# EAGLE design controller (EAGLE 8.3.1)
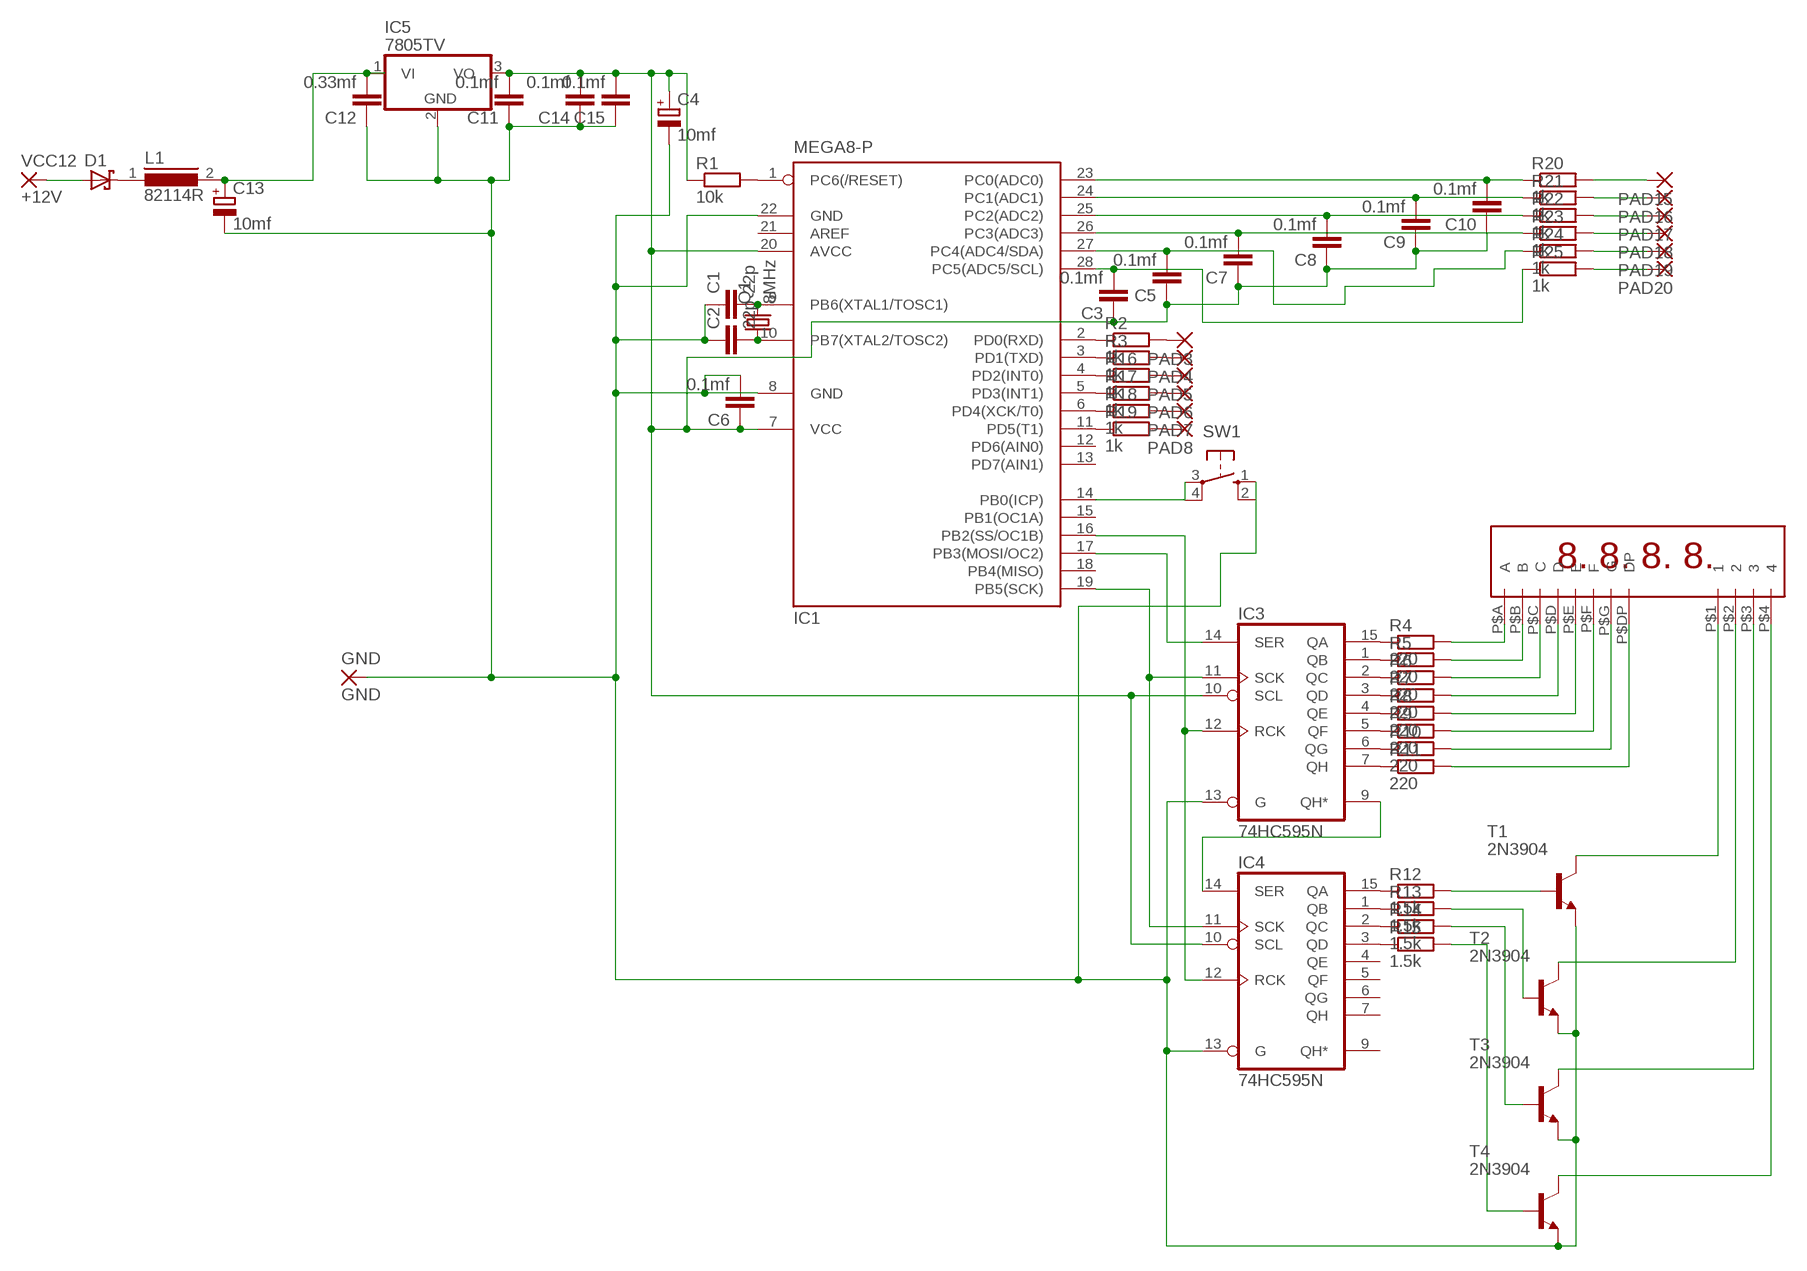
[diagram p0: schematic, sheet 1]

## Parts
C1  22p  C-EU050-024X044  [C050-024X044]
C2  22p  C-EU050-024X044  [C050-024X044]
C3  0.1mf  C-EU050-024X044  [C050-024X044]
C4  10mf  CPOL-EUE1.8-4  [E1,8-4]
C5  0.1mf  C-EU050-024X044  [C050-024X044]
C6  0.1mf  C-EU050-024X044  [C050-024X044]
C7  0.1mf  C-EU050-024X044  [C050-024X044]
C8  0.1mf  C-EU050-024X044  [C050-024X044]
C9  0.1mf  C-EU050-024X044  [C050-024X044]
C10  0.1mf  C-EU050-024X044  [C050-024X044]
C11  0.1mf  C-EU050-024X044  [C050-024X044]
C12  0.33mf  C-EU050-024X044  [C050-024X044]
C13  10mf  CPOL-EUE1.8-4  [E1,8-4]
C14  0.1mf  C-EU050-024X044  [C050-024X044]
C15  0.1mf  C-EU050-024X044  [C050-024X044]
D1  SCHOTTKY-DIODEDO35-7  [DO35-7]
GND  GND  2,54/1,1  [2,54/1,1]
IC1  MEGA8-P  [DIL28-3]
IC3  74HC595N  [DIL16]
IC4  74HC595N  [DIL16]
IC5  7805TV  [TO220V]
L1  82114R  [82114R]
PAD3  1,6/0,8  [1,6/0,8]
PAD4  1,6/0,8  [1,6/0,8]
PAD5  1,6/0,8  [1,6/0,8]
PAD6  1,6/0,8  [1,6/0,8]
PAD7  1,6/0,8  [1,6/0,8]
PAD8  1,6/0,8  [1,6/0,8]
PAD15  1,6/0,8  [1,6/0,8]
PAD16  1,6/0,8  [1,6/0,8]
PAD17  1,6/0,8  [1,6/0,8]
PAD18  1,6/0,8  [1,6/0,8]
PAD19  1,6/0,8  [1,6/0,8]
PAD20  1,6/0,8  [1,6/0,8]
Q1  8MHz  CRYSTALHC49S  [HC49/S]
R1  10k  R-EU_0204/7  [0204/7]
R2  1k  R-EU_0204/7  [0204/7]
R3  1k  R-EU_0204/7  [0204/7]
R4  220  R-EU_0204/7  [0204/7]
R5  220  R-EU_0204/7  [0204/7]
R6  220  R-EU_0204/7  [0204/7]
R7  220  R-EU_0204/7  [0204/7]
R8  220  R-EU_0204/7  [0204/7]
R9  220  R-EU_0204/7  [0204/7]
R10  220  R-EU_0204/7  [0204/7]
R11  220  R-EU_0204/7  [0204/7]
R12  1.5k  R-EU_0204/7  [0204/7]
R13  1.5k  R-EU_0204/7  [0204/7]
R14  1.5k  R-EU_0204/7  [0204/7]
R15  1.5k  R-EU_0204/7  [0204/7]
R16  1k  R-EU_0204/7  [0204/7]
R17  1k  R-EU_0204/7  [0204/7]
R18  1k  R-EU_0204/7  [0204/7]
R19  1k  R-EU_0204/7  [0204/7]
R20  1k  R-EU_0204/7  [0204/7]
R21  1k  R-EU_0204/7  [0204/7]
R22  1k  R-EU_0204/7  [0204/7]
R23  1k  R-EU_0204/7  [0204/7]
R24  1k  R-EU_0204/7  [0204/7]
R25  1k  R-EU_0204/7  [0204/7]
SW1  10-XX  [B3F-10XX]
T1  2N3904  [TO92]
T2  2N3904  [TO92]
T3  2N3904  [TO92]
T4  2N3904  [TO92]
U$1  KL-5641-ASR  [KL-5641-ASR]
VCC12  +12V  2,54/1,1  [2,54/1,1]

## Nets
GND: C1.1 C2.1 C4.- C6.2 C11.1 C12.1 C13.- C14.1 C15.1 GND.1(P) IC1.8(GND) IC1.22(GND) IC3.13(G) IC4.13(G) IC5.2(GND) SW1.1(S) SW1.2(S1) T1.3(E) T2.3(E) T3.3(E) T4.3(E)
N$1: IC1.1(PC6(/RESET)) R1.2
N$2: D1.C L1.1
N$3: IC1.2(PD0(RXD)) R2.1
N$4: R4.2 U$1.P$A(A)
N$5: R5.2 U$1.P$B(B)
N$6: IC1.3(PD1(TXD)) R3.1
N$7: C1.2 IC1.9(PB6(XTAL1/TOSC1)) Q1.2
N$8: C2.2 IC1.10(PB7(XTAL2/TOSC2)) Q1.1
N$9: R6.2 U$1.P$C(C)
N$10: R7.2 U$1.P$D(D)
N$11: R8.2 U$1.P$E(E)
N$12: R9.2 U$1.P$F(F)
N$13: IC1.16(PB2(SS/OC1B)) IC3.12(RCK) IC4.12(RCK)
N$14: IC1.17(PB3(MOSI/OC2)) IC3.14(SER)
N$15: IC1.19(PB5(SCK)) IC3.11(SCK) IC4.11(SCK)
N$16: C12.2 C13.+ IC5.1(VI) L1.2
N$17: R10.2 U$1.P$G(G)
N$18: R11.2 U$1.P$DP(DP)
N$19: IC3.15(QA) R4.1
N$20: IC3.1(QB) R5.1
N$21: IC3.2(QC) R6.1
N$22: IC3.3(QD) R7.1
N$23: IC3.4(QE) R8.1
N$24: IC3.5(QF) R9.1
N$25: IC3.6(QG) R10.1
N$26: IC3.7(QH) R11.1
N$27: IC4.15(QA) R12.1
N$28: IC4.1(QB) R13.1
N$29: IC4.2(QC) R14.1
N$30: IC4.3(QD) R15.1
N$31: R12.2 T1.2(B)
N$32: R13.2 T2.2(B)
N$33: R14.2 T3.2(B)
N$34: R15.2 T4.2(B)
N$35: D1.A VCC12.1(P)
N$36: T1.1(C) U$1.P$1
N$37: T2.1(C) U$1.P$2
N$38: T3.1(C) U$1.P$3
N$39: T4.1(C) U$1.P$4
N$40: C10.2 IC1.23(PC0(ADC0)) R20.1
N$41: C9.2 IC1.24(PC1(ADC1)) R21.1
N$42: C8.2 IC1.25(PC2(ADC2)) R22.1
N$43: C7.2 IC1.26(PC3(ADC3)) R23.1
N$44: C5.2 IC1.27(PC4(ADC4/SDA)) R24.1
N$45: PAD16.1(P) R21.2
N$46: IC1.4(PD2(INT0)) R16.1
N$47: IC1.5(PD3(INT1)) R17.1
N$48: IC1.6(PD4(XCK/T0)) R18.1
N$49: IC1.11(PD5(T1)) R19.1
N$50: PAD3.1(P) R2.2
N$51: PAD4.1(P) R3.2
N$52: PAD5.1(P) R16.2
N$53: PAD6.1(P) R17.2
N$54: PAD7.1(P) R18.2
N$55: PAD8.1(P) R19.2
N$56: IC1.14(PB0(ICP)) SW1.3(P) SW1.4(P1)
N$58: PAD15.1(P) R20.2
N$59: PAD17.1(P) R22.2
N$60: PAD18.1(P) R23.2
N$61: PAD19.1(P) R24.2
N$62: PAD20.1(P) R25.2
N$63: C3.2 IC1.28(PC5(ADC5/SCL)) R25.1
N$64: IC3.9(QH*) IC4.14(SER)
VCC: C3.1 C4.+ C5.1 C6.1 C7.1 C8.1 C9.1 C10.1 C11.2 C14.2 C15.2 IC1.7(VCC) IC1.20(AVCC) IC3.10(SCL) IC4.10(SCL) IC5.3(VO) R1.1
Unconnected: IC1.12(PD6(AIN0)) IC1.13(PD7(AIN1)) IC1.15(PB1(OC1A)) IC1.18(PB4(MISO)) IC1.21(AREF) IC4.4(QE) IC4.5(QF) IC4.6(QG) IC4.7(QH) IC4.9(QH*)

## Power pins joined to a net without a drawn wire
GND: IC3.8(GND) IC4.8(GND)
VCC: IC3.16(VCC) IC4.16(VCC)

## Library data of the parts
C1-C3 C5-C12 C14 C15 = resistor:C-EU: CAPACITOR, European symbol
C4 C13 = resistor:CPOL-EU: POLARIZED CAPACITOR, European symbol
D1 = adafruit:SCHOTTKY-DIODE: Schottky Diode
GND VCC12 = wirepad:2,54/1,1: THROUGH-HOLE PAD
IC1 = atmel:MEGA8-P: MICROCONTROLLER 8 Kbytes FLASH, 1 kbytes SRAM, 512 bytes EEPROM, USART, 4-channel 10 bit ADC, 2-channel 8 bit ADC Pin compatible with Atmega48, ATMega88, ATMega168 Source: avr.lbr; OC_FARNELL: unknown; OC_NEWARK: unknown
IC3 IC4 = 74xx-eu:74*595: 8-bit SHIFT REGISTER, output latch
IC5 = linear:78*: Positive VOLTAGE REGULATOR Source: http://cache.national.com/ds/LM/LM78L05.pdf http://www.fairchildsemi.com/ds/LM/LM7805.pdf
L1 = inductors:82114R: INDUCTOR
PAD3-PAD8 PAD15-PAD20 = wirepad:1,6/0,8: THROUGH-HOLE PAD
Q1 = adafruit:CRYSTAL: CRYSTAL; OC_FARNELL: 1667008; OC_NEWARK: unknown
R1-R25 = resistor:R-EU_: RESISTOR, European symbol
SW1 = buttons:10-XX: OMRON SWITCH
T1-T4 = transistor:2N3904: NPN TRANSISTOR
U$1 = mgvc:KL-5641-ASR: Индикатор 4 разряда 0.56" Красный, катод, черный фон KL-5641-ASR

## Board
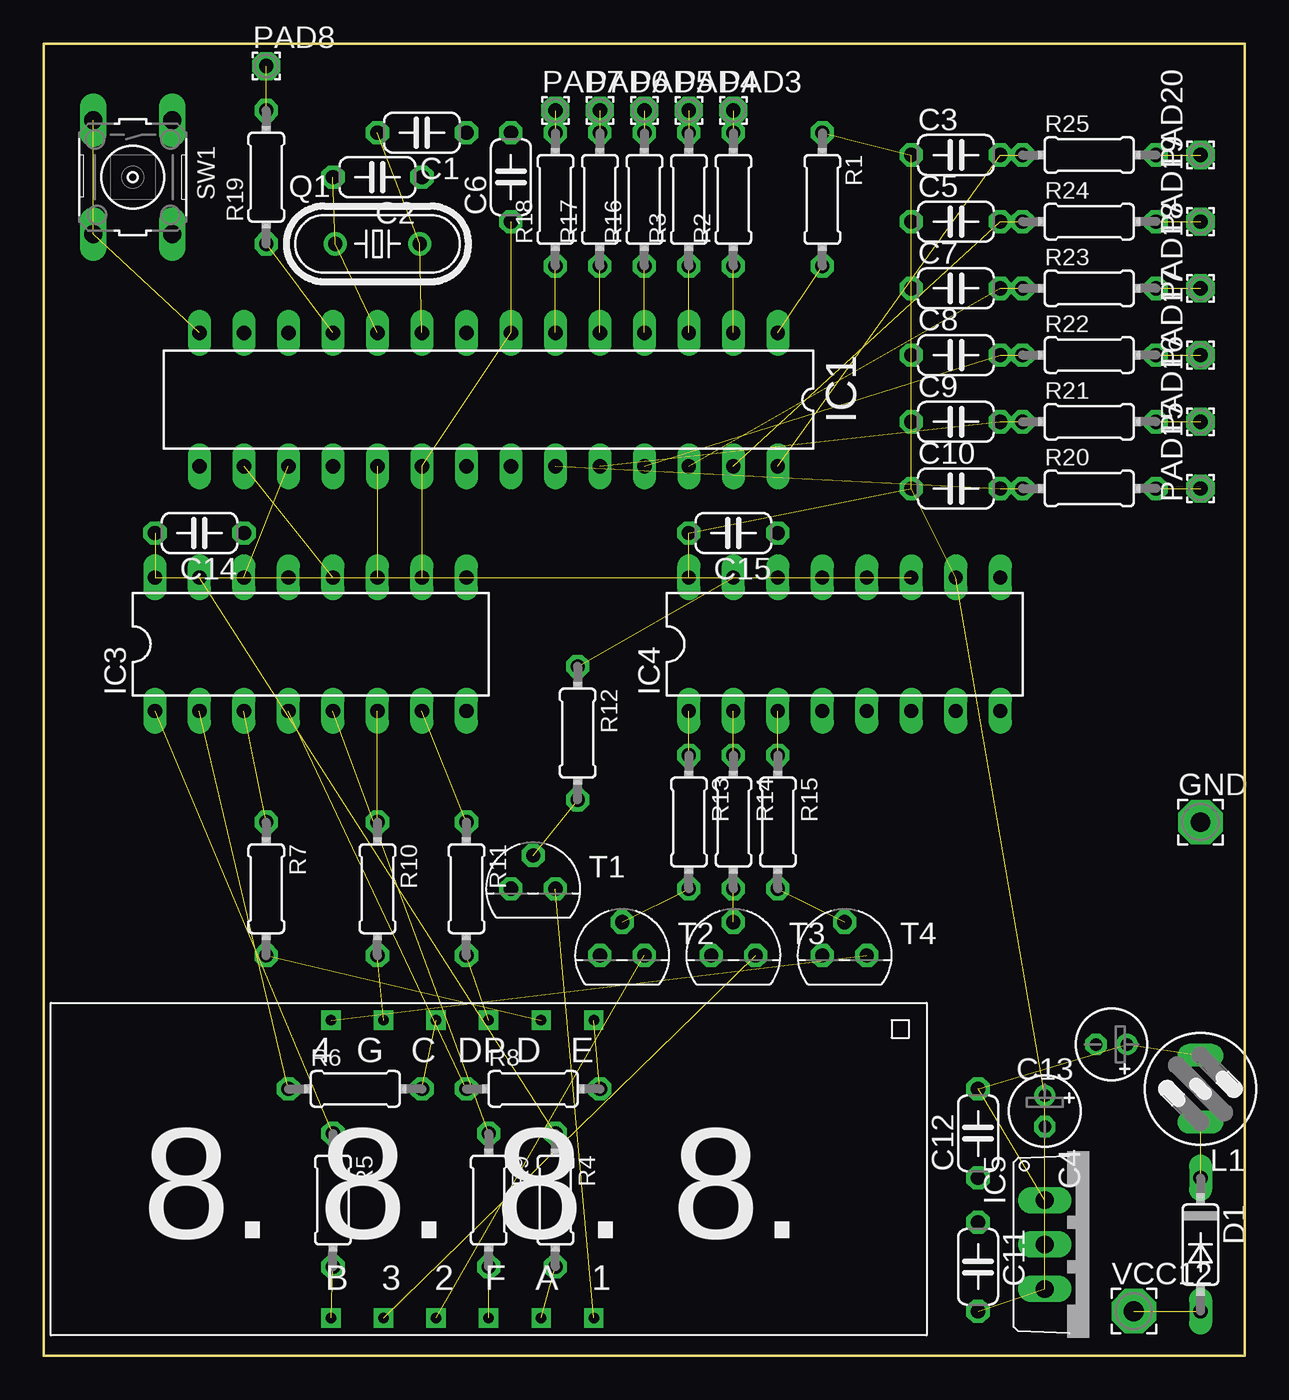
[diagram p1: board, top side]
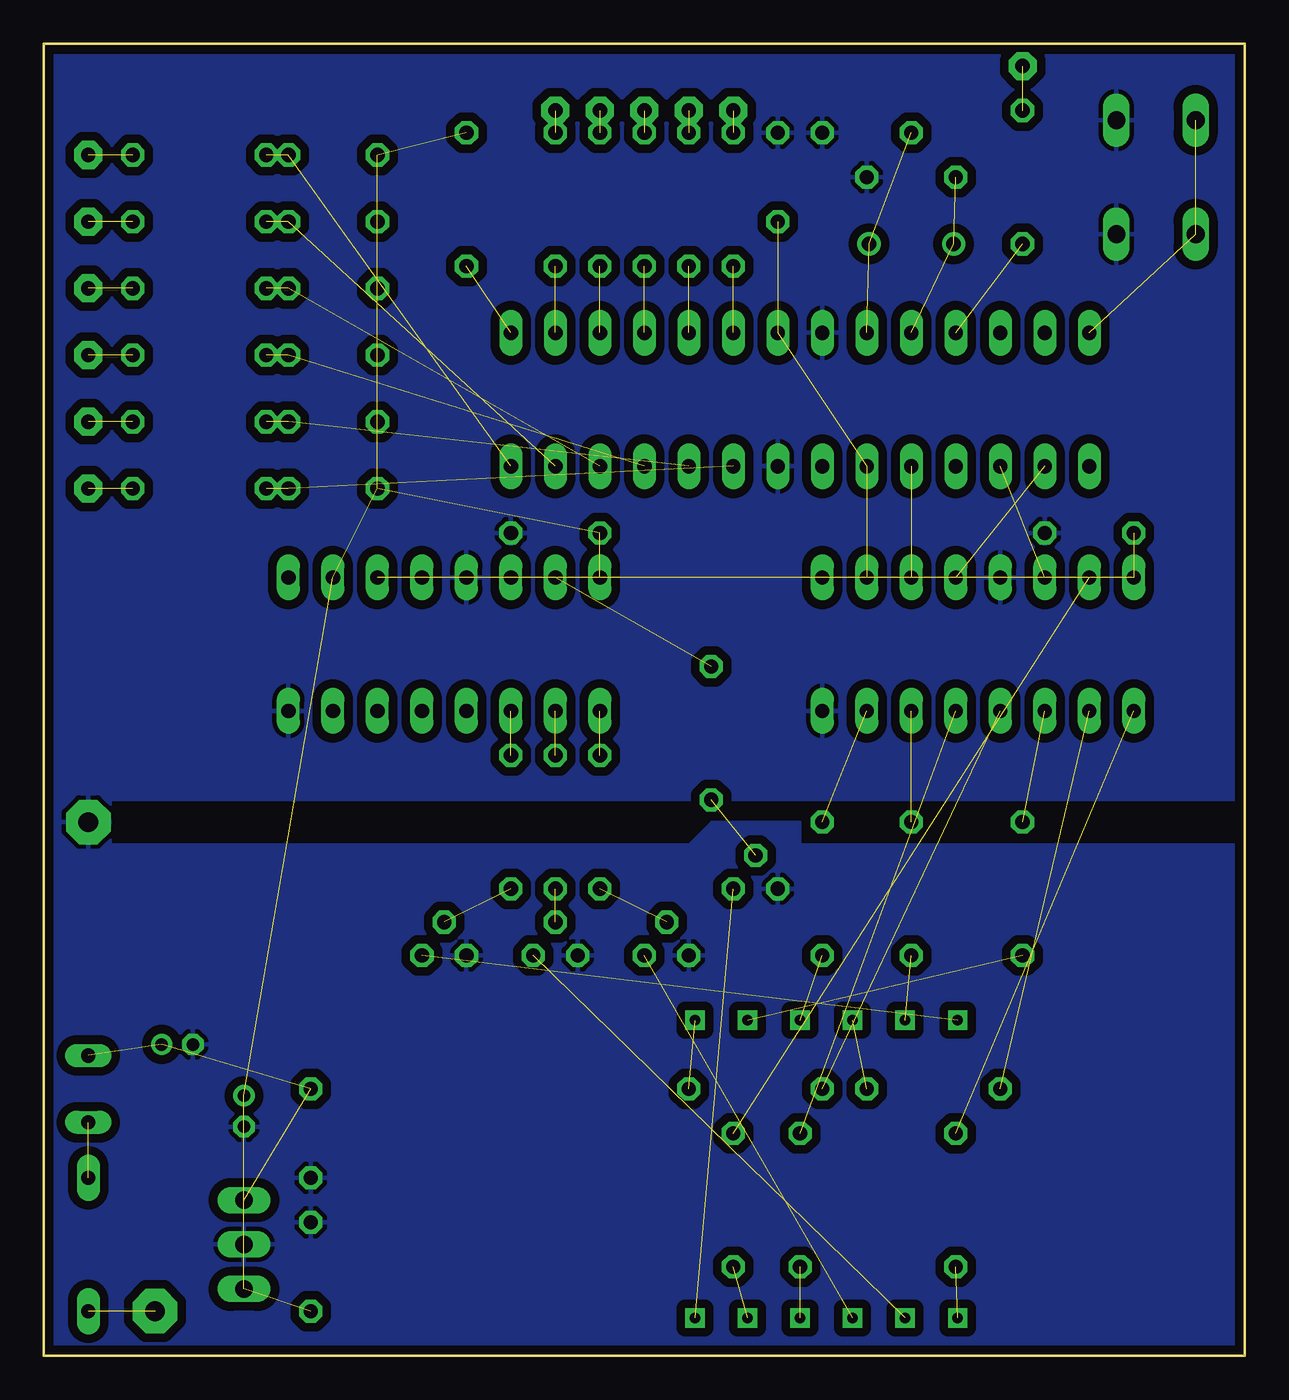
[diagram p2: board, bottom side, seen from below]

Size 68.58 x 74.93 mm. Coordinates in mm from the lower left corner, seen from the top.
Outline: 0,74.93 0,0 68.58,0 68.58,74.93 0,74.93
Copper layers (1*16): Top 0.035mm / dielectric 1.5mm / Bottom 0.035mm
Design rules "default *": minimum track width 0.7mm, minimum drill 0.35mm, track to track 0.5mm, track to pad 0.5mm, pad to pad 6mil, via to via 6mil, smd to smd 6mil, copper to edge 0.5mm, drill to drill 6mil, minimum pad ring 10mil, minimum via ring 8mil, stop-mask expansion 4mil, vias tented up to drill 0mil, thermal gap 10mil

### Footprints (pad centres in the part's own frame; a part is rotated, then mirrored left to right if it is on the bottom)
C050-024X044 = drill 0.813 octagon: 1 -2.54,0; 2 2.54,0
E1,8-4 = drill 0.711 pad 1.168: + -0.889,0 | drill 0.711 pad 1.168 octagon: - 0.889,0
DO35-7 = drill 0.813 long: A 3.81,0; C -3.81,0
2,54/1,1 = drill 1.118 pad 2.54 octagon: 1 0,0
DIL28-3 = drill 0.813 long: 1 -16.51,-3.81; 2 -13.97,-3.81; 3 -11.43,-3.81; 4 -8.89,-3.81; 5 -6.35,-3.81; 6 -3.81,-3.81; 7 -1.27,-3.81; 8 1.27,-3.81; 9 3.81,-3.81; 10 6.35,-3.81; 11 8.89,-3.81; 12 11.43,-3.81; 13 13.97,-3.81; 14 16.51,-3.81; 15 16.51,3.81; 16 13.97,3.81; 17 11.43,3.81; 18 8.89,3.81; 19 6.35,3.81; 20 3.81,3.81; 21 1.27,3.81; 22 -1.27,3.81; 23 -3.81,3.81; 24 -6.35,3.81; 25 -8.89,3.81; 26 -11.43,3.81; 27 -13.97,3.81; 28 -16.51,3.81
DIL16 = drill 0.813 long: 1 -8.89,-3.81; 2 -6.35,-3.81; 3 -3.81,-3.81; 4 -1.27,-3.81; 5 1.27,-3.81; 6 3.81,-3.81; 7 6.35,-3.81; 8 8.89,-3.81; 9 8.89,3.81; 10 6.35,3.81; 11 3.81,3.81; 12 1.27,3.81; 13 -1.27,3.81; 14 -3.81,3.81; 15 -6.35,3.81; 16 -8.89,3.81
TO220V = drill 1.016 long: 1 -2.54,-2.54; 2 0,-2.54; 3 2.54,-2.54
82114R = drill 0.813 long: 1 0,1.905; 2 0,-1.905
1,6/0,8 = drill 0.813 pad 1.6 octagon: 1 0,0
HC49/S = drill 0.813: 1 -2.413,0; 2 2.413,0
0204/7 = drill 0.813 octagon: 1 -3.81,0; 2 3.81,0
B3F-10XX = drill 1.016 long: 1 -3.251,2.261; 2 3.251,2.261; 3 -3.251,-2.261; 4 3.251,-2.261
TO92 = drill 0.813 octagon: 1 1.27,0; 2 0,1.905; 3 -1.27,0
KL-5641-ASR = drill 0.6 square: P$1 -6,8; P$2 3,8; P$3 6,8; P$4 9,-9; P$A -3,8; P$B 9,8; P$C 3,-9; P$D -3,-9; P$DP 0,-9; P$E -6,-9; P$F 0,8; P$G 6,-9

### Placement (x,y rotation side)
C1  21.59,69.85 180 top
C2  19.05,67.31 180 top
C3  52.07,68.58 0 top
C4  57.15,13.97 270 top
C5  52.07,64.77 0 top
C6  26.67,67.31 90 top
C7  52.07,60.96 0 top
C8  52.07,57.15 0 top
C9  52.07,53.34 0 top
C10  52.07,49.53 0 top
C11  53.34,5.08 270 top
C12  53.34,12.7 90 top
C13  60.96,17.78 180 top
C14  8.89,46.99 180 top
C15  39.37,46.99 180 top
D1  66.04,6.35 270 top
GND  66.04,30.48 0 top
IC1  25.4,54.61 180 top
IC3  15.24,40.64 0 top
IC4  45.72,40.64 0 top
IC5  59.69,6.35 270 top
L1  66.04,15.24 180 top
PAD3  39.37,71.12 0 top
PAD4  36.83,71.12 0 top
PAD5  34.29,71.12 0 top
PAD6  31.75,71.12 0 top
PAD7  29.21,71.12 0 top
PAD8  12.7,73.66 0 top
PAD15  66.04,49.53 90 top
PAD16  66.04,53.34 90 top
PAD17  66.04,57.15 90 top
PAD18  66.04,60.96 90 top
PAD19  66.04,64.77 90 top
PAD20  66.04,68.58 90 top
Q1  19.05,63.5 0 top
R1  44.45,66.04 270 top
R2  39.37,66.04 90 top
R3  36.83,66.04 90 top
R4  29.21,8.89 270 top
R5  16.51,8.89 270 top
R6  17.78,15.24 0 top
R7  12.7,26.67 270 top
R8  27.94,15.24 0 top
R9  25.4,8.89 270 top
R10  19.05,26.67 270 top
R11  24.13,26.67 270 top
R12  30.48,35.56 270 top
R13  36.83,30.48 270 top
R14  39.37,30.48 270 top
R15  41.91,30.48 270 top
R16  34.29,66.04 90 top
R17  31.75,66.04 90 top
R18  29.21,66.04 90 top
R19  12.7,67.31 90 top
R20  59.69,49.53 0 top
R21  59.69,53.34 0 top
R22  59.69,57.15 0 top
R23  59.69,60.96 0 top
R24  59.69,64.77 0 top
R25  59.69,68.58 0 top
SW1  5.08,67.31 270 top
T1  27.94,26.67 0 top
T2  33.02,22.86 0 top
T3  39.37,22.86 0 top
T4  45.72,22.86 0 top
U$1  25.4,10.16 180 top
VCC12  62.23,2.54 0 top

### Tracks (layer width: path | path; a pad name or v marks a point on that pad's centre or on a via)
GND
  pour Bottom: 68.58,33.02 68.58,73.66 68.58,74.93 0,74.93 0,31.75 63.5,31.75 64.77,31.75 64.77,29.21 0,29.21 0,0 68.58,0
N$1  (1 unrouted)
N$2  (1 unrouted)
N$3  (1 unrouted)
N$4  (1 unrouted)
N$5  (1 unrouted)
N$6  (1 unrouted)
N$7  (2 unrouted)
N$8  (2 unrouted)
N$9  (1 unrouted)
N$10  (1 unrouted)
N$11  (1 unrouted)
N$12  (1 unrouted)
N$13  (2 unrouted)
N$14  (1 unrouted)
N$15  (2 unrouted)
N$16  (3 unrouted)
N$17  (1 unrouted)
N$18  (1 unrouted)
N$19  (1 unrouted)
N$20  (1 unrouted)
N$21  (1 unrouted)
N$22  (1 unrouted)
N$23  (1 unrouted)
N$24  (1 unrouted)
N$25  (1 unrouted)
N$26  (1 unrouted)
N$27  (1 unrouted)
N$28  (1 unrouted)
N$29  (1 unrouted)
N$30  (1 unrouted)
N$31  (1 unrouted)
N$32  (1 unrouted)
N$33  (1 unrouted)
N$34  (1 unrouted)
N$35  (1 unrouted)
N$36  (1 unrouted)
N$37  (1 unrouted)
N$38  (1 unrouted)
N$39  (1 unrouted)
N$40  (2 unrouted)
N$41  (2 unrouted)
N$42  (2 unrouted)
N$43  (2 unrouted)
N$44  (2 unrouted)
N$45  (1 unrouted)
N$46  (1 unrouted)
N$47  (1 unrouted)
N$48  (1 unrouted)
N$49  (1 unrouted)
N$50  (1 unrouted)
N$51  (1 unrouted)
N$52  (1 unrouted)
N$53  (1 unrouted)
N$54  (1 unrouted)
N$55  (1 unrouted)
N$56  (2 unrouted)
N$57
  pour Bottom: 25.4,29.21 25.4,30.48 30.48,30.48 31.75,29.21
N$58  (1 unrouted)
N$59  (1 unrouted)
N$60  (1 unrouted)
N$61  (1 unrouted)
N$62  (1 unrouted)
N$63  (2 unrouted)
N$64  (1 unrouted)
VCC  (18 unrouted)